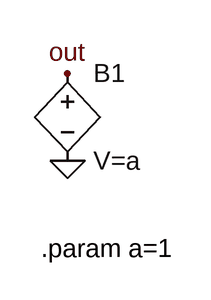
[diagram p0: schematic coefficient.asc]
coefficient.asc, the LTspice schematic file:
Version 4
SHEET 1 880 680
FLAG 224 144 0
FLAG 224 64 out
SYMBOL bv 224 48 R0
SYMATTR InstName B1
SYMATTR Value V=a
TEXT 200 224 Left 2 !.param a=1

The netlist it stands for:
* coefficient.asc
B1 out 0 V=a
.param a=1
.backanno
.end